# EAGLE schematic ss (EAGLE 6.1)
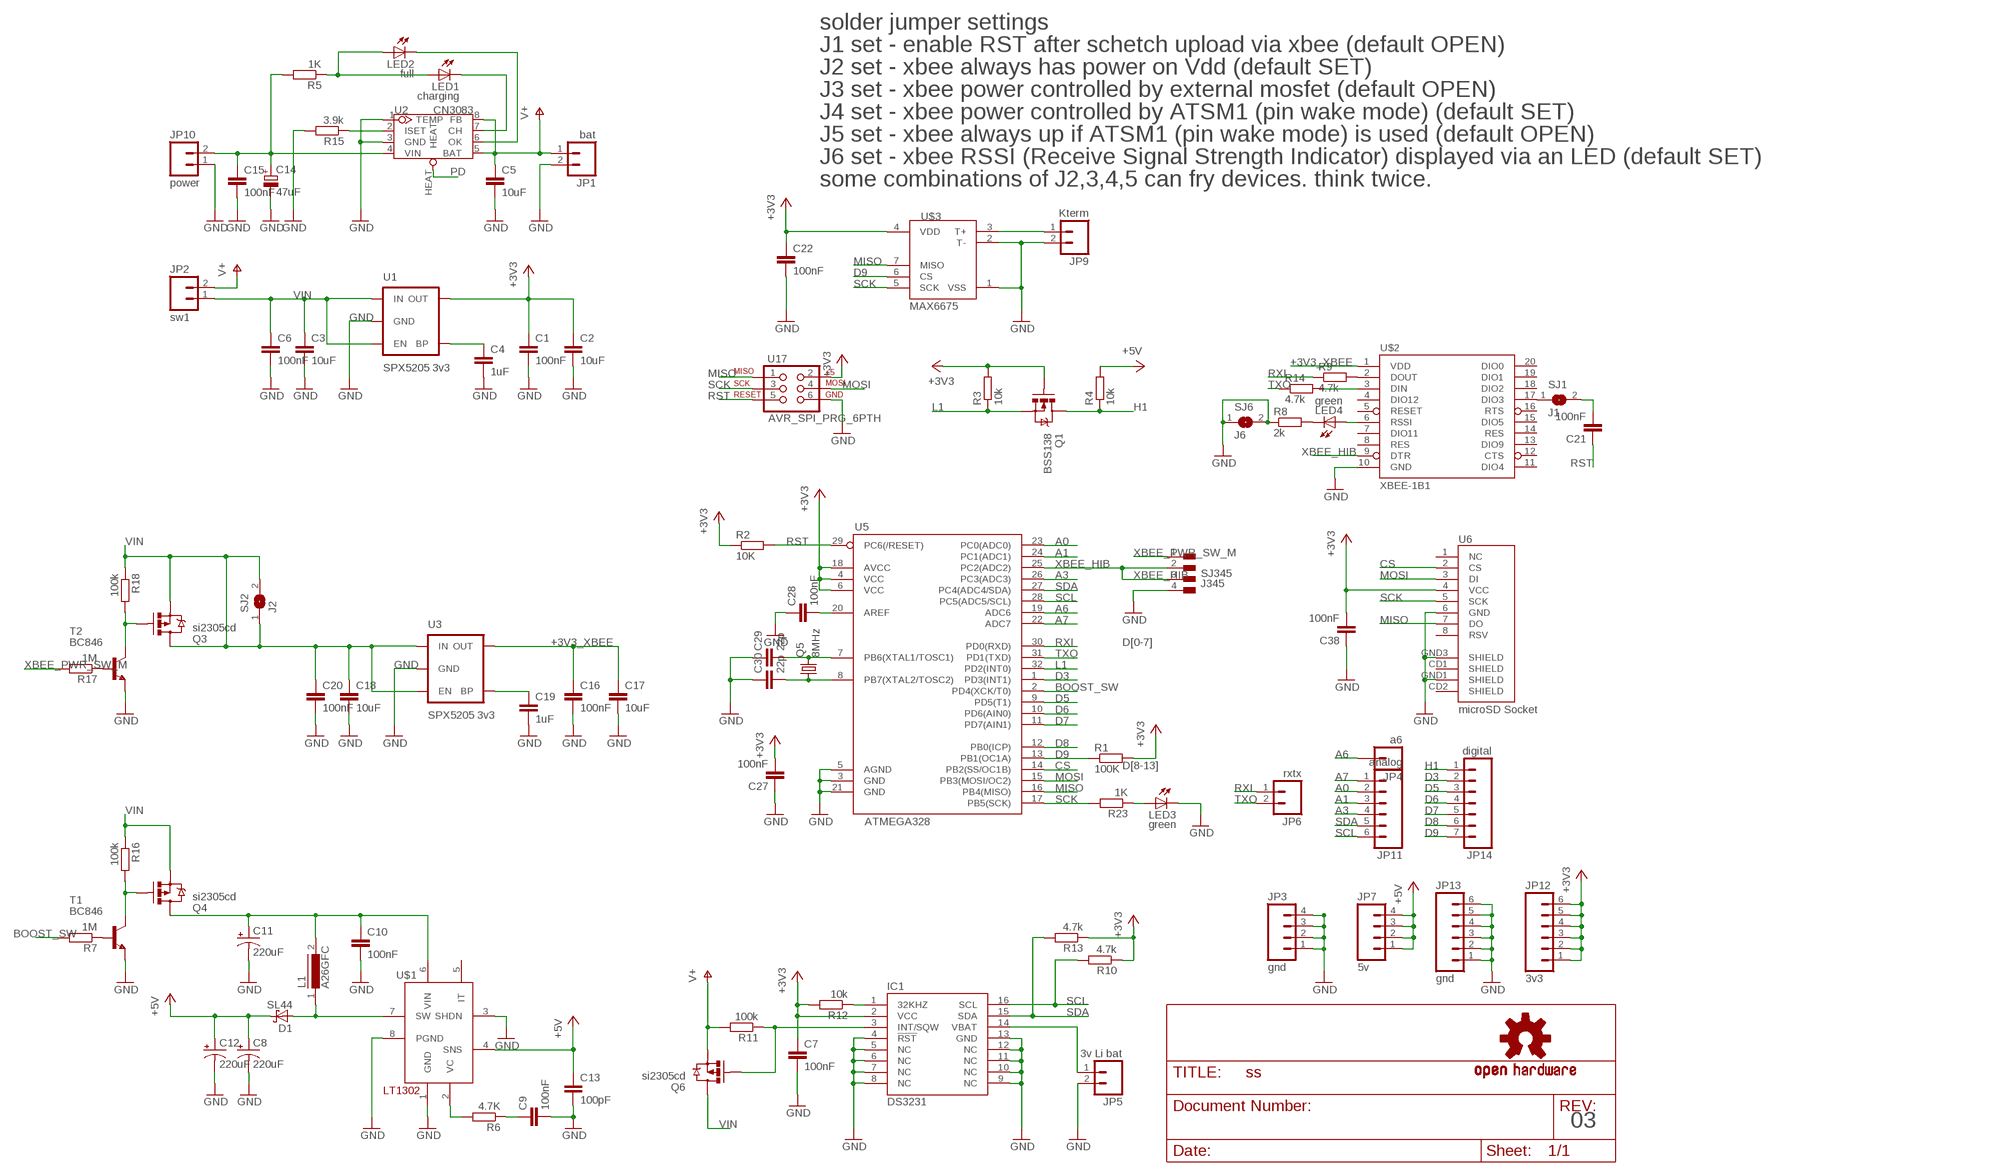
[diagram p0: schematic, sheet 1]

## Parts
C1  100nF  C-EUC0805  [C0805]
C2  10uF  C-EUC1206  [C1206]
C3  10uF  C-EUC1206  [C1206]
C4  1uF  C-EUC0805  [C0805]
C5  10uF  C-EUC1206  [C1206]
C6  100nF  C-EUC0805  [C0805]
C7  100nF  C-EUC0805  [C0805]
C8  220uF  CAP_POLD  [PANASONIC_D]
C9  100nF  C-EUC0805  [C0805]
C10  100nF  C-EUC0805  [C0805]
C11  220uF  CAP_POLD  [PANASONIC_D]
C12  220uF  CAP_POLD  [PANASONIC_D]
C13  100pF  C-EUC0805  [C0805]
C14  47uF  CPOL-EUCT7343  [CT7343]
C15  100nF  C-EUC0805  [C0805]
C16  100nF  C-EUC0805  [C0805]
C17  10uF  C-EUC1206  [C1206]
C18  10uF  C-EUC1206  [C1206]
C19  1uF  C-EUC0805  [C0805]
C20  100nF  C-EUC0805  [C0805]
C21  100nF  C-EUC0805  [C0805]
C22  100nF  C-EUC0805  [C0805]
C27  100nF  C-EUC0805  [C0805]
C28  100nF  C-EUC0805  [C0805]
C29  22p  C-EUC0805  [C0805]
C30  22p  C-EUC0805  [C0805]
C38  100nF  C-EUC0805  [C0805]
D1  SL44  SCHOTTKY-DIODESMC  [SMC]
IC1  DS3231  [SO-16]
JP1  bat  M02PTH  [1X02]
JP2  sw1  M02PTH  [1X02]
JP3  gnd  M04PTH  [1X04]
JP4  a6  M01PTH  [1X01]
JP5  3v Li bat  M02PTH  [1X02]
JP6  rxtx  M02PTH  [1X02]
JP7  5v  M04PTH  [1X04]
JP9  Kterm  M02PTH  [1X02]
JP10  power  M02PTH  [1X02]
JP11  analog  M06SIP  [1X06]
JP12  3v3  M06SIP  [1X06]
JP13  gnd  M06SIP  [1X06]
JP14  digital  M07  [1X07]
L1  A26GFC  [A26GFC]
LED1  charging  LEDCHIP-LED0805  [CHIP-LED0805]
LED2  full  LEDCHIP-LED0805  [CHIP-LED0805]
LED3  green  LEDCHIP-LED0805  [CHIP-LED0805]
LED4  green  LEDCHIP-LED0805  [CHIP-LED0805]
Q1  BSS138  MOSFET-NCHANNELSMD  [SOT23-3]
Q3  si2305cd  MOSFET-PCHANNELSMD_POWER  [SOT23-3_POWER]
Q4  si2305cd  MOSFET-PCHANNELSMD_POWER  [SOT23-3_POWER]
Q5  8MHz  CRYTAL  [CRYSTAL_5X3.2]
Q6  si2305cd  MOSFET-PCHANNELSMD_POWER  [SOT23-3_POWER]
R1  100K  R-EU_R0805W  [R0805W]
R2  10K  R-EU_R0805W  [R0805W]
R3  10k  R-EU_R0805W  [R0805W]
R4  10k  R-EU_R0805W  [R0805W]
R5  1K  R-EU_R0805W  [R0805W]
R6  4.7K  R-EU_R0805W  [R0805W]
R7  1M  R-EU_R0805W  [R0805W]
R8  2k  R-EU_R0805W  [R0805W]
R9  4.7k  R-EU_R0805W  [R0805W]
R10  4.7k  R-EU_R0805W  [R0805W]
R11  100k  R-EU_R0805W  [R0805W]
R12  10k  R-EU_R0805W  [R0805W]
R13  4.7k  R-EU_R0805W  [R0805W]
R14  4.7k  R-EU_R0805W  [R0805W]
R15  3.9k  R-EU_R0805W  [R0805W]
R16  100k  R-EU_R0805W  [R0805W]
R17  1M  R-EU_R0805W  [R0805W]
R18  100k  R-EU_R0805W  [R0805W]
R23  1K  R-EU_R0805W  [R0805W]
SJ1  J1  SJ  [SJ]
SJ2  J2  SJ  [SJ]
SJ6  J6  SJ  [SJ]
SJ345  J345  SJ_4P  [SJ_4P]
T1  BC846  [SOT23]
T2  BC846  [SOT23]
U1  SPX5205 3v3  V_REG_LDOSMD  [SOT23-5]
U2  CN3083  [SOP8-W/-HEAT]
U3  SPX5205 3v3  V_REG_LDOSMD  [SOT23-5]
U5  ATMEGA328  ATMEGA168  [TQFP32-08]
U6  microSD Socket  USD-SOCKETNEW  [MICRO-SD-SOCKET-PP]
U17  AVR_SPI_PRG_6PTH  [2X3]
U$1  LT1302SOIC8  [SO08]
U$2  XBEE-1B1  [XBEE-1]
U$3  MAX6675  [SO08-MAX6675]
U$7  OSHW-LOGOM  [OSHW-LOGO-M]

## Nets
+3V3: C1.1 C2.1 C7.1 C22.1 C27.2 C38.2 IC1.2(VCC) JP12.1 JP12.2 JP12.3 JP12.4 JP12.5 JP12.6 Q1.1(G) R1.2 R2.1 R3.2 R10.1 R12.2 R13.1 U1.5(OUT) U5.4(VCC) U5.6(VCC) U5.18(AVCC) U6.4(VCC) U17.2 U$3.4(VDD)
+3V3_XBEE: C16.1 C17.1 U3.5(OUT) U$2.1(VDD)
+5V: C8.+ C12.+ C13.1 D1.C JP7.1 JP7.2 JP7.3 JP7.4 R4.2 U$1.4(SNS)
A0: JP11.2 U5.23(PC0(ADC0))
A1: JP11.3 U5.24(PC1(ADC1))
A3: JP11.4 U5.26(PC3(ADC3))
A6: JP4.1 U5.19(ADC6)
A7: JP11.1 U5.22(ADC7)
BOOST_IN: C10.1 C11.+ L1.2 Q4.3(D) U$1.6(VIN)
BOOST_SW: R7.2 U5.2(PD4(XCK/T0))
CS: U5.14(PB2(SS/OC1B)) U6.2(CS)
D3: JP14.2 U5.1(PD3(INT1))
D5: JP14.3 U5.9(PD5(T1))
D6: JP14.4 U5.10(PD6(AIN0))
D7: JP14.5 U5.11(PD7(AIN1))
D8: JP14.6 U5.12(PB0(ICP))
D9: JP14.7 R1.1 U5.13(PB1(OC1A)) U$3.6(CS)
GND: C1.2 C2.2 C3.2 C4.2 C5.2 C6.2 C7.2 C8.- C9.2 C10.2 C11.- C12.- C13.2 C14.- C15.2 C16.2 C17.2 C18.2 C19.2 C20.2 C22.2 C27.1 C28.1 C29.1 C30.1 C38.1 IC1.4(!RST) IC1.5(NC) IC1.6(NC) IC1.7(NC) IC1.8(NC) IC1.9(NC) IC1.10(NC) IC1.11(NC) IC1.12(NC) IC1.13(GND) JP1.2 JP3.1 JP3.2 JP3.3 JP3.4 JP5.2 JP9.2 JP10.1 JP13.1 JP13.2 JP13.3 JP13.4 JP13.5 JP13.6 LED3.C R8.1 R15.2 SJ6.1 SJ6.2 SJ345.4 T1.2(E) T2.2(E) U1.2(GND) U2.1(TEMP) U2.3(GND) U3.2(GND) U5.3(GND) U5.5(AGND) U5.21(GND) U6.6(GND) U6.GND1(SHIELD) U6.GND3(SHIELD) U17.6 U$1.1(GND) U$1.3(SHDN) U$1.8(PGND) U$2.10(GND) U$3.1(VSS) U$3.2(T-)
H1: JP14.1 Q1.3(D) R4.1
L1: Q1.2(S) R3.1 U5.32(PD2(INT0))
MISO: U5.16(PB4(MISO)) U6.7(DO) U17.1 U$3.7(MISO)
MOSI: U5.15(PB3(MOSI/OC2)) U6.3(DI) U17.4
N$1: IC1.3(INT/SQW) Q6.1(G) R11.1
N$2: C4.1 U1.4(BP)
N$3: D1.A L1.1 U$1.7(SW)
N$4: SJ1.1 U$2.17(DIO3)
N$5: C19.1 U3.4(BP)
N$6: LED4.C R8.2
N$7: LED4.A U$2.6(RSSI)
N$8: IC1.1(32KHZ) R12.1
N$9: R15.1 U2.2(ISET)
N$10: IC1.14(VBAT) JP5.1
N$11: R6.2 U$1.2(VC)
N$12: C14.+ C15.1 JP10.2 R5.2 U2.4(VIN)
N$13: C9.1 R6.1
N$14: LED1.A LED2.A R5.1
N$15: LED1.C U2.7(CH)
N$16: LED2.C U2.6(OK)
N$17: C21.2 SJ1.2
N$18: R17.1 T2.1(B)
N$19: C30.2 Q5.P$1 U5.8(PB7(XTAL2/TOSC2))
N$20: Q3.1(G) R18.2 T2.3(C)
N$21: C29.2 Q5.P$2 U5.7(PB6(XTAL1/TOSC1))
N$22: C28.2 U5.20(AREF)
N$24: R9.2 U$2.2(DOUT)
N$25: R14.2 U$2.3(DIN)
N$26: R7.1 T1.1(B)
N$27: Q4.1(G) R16.2 T1.3(C)
N$34: LED3.A R23.1
PD: U2.HEAT
RST: C21.1 R2.2 U5.29(PC6(/RESET)) U17.5
RXI: JP6.1 R9.1 U5.30(PD0(RXD))
SCK: R23.2 U5.17(PB5(SCK)) U6.5(SCK) U17.3 U$3.5(SCK)
SCL: IC1.16(SCL) JP11.6 R10.2 U5.28(PC5(ADC5/SCL))
SDA: IC1.15(SDA) JP11.5 R13.2 U5.27(PC4(ADC4/SDA))
T+: JP9.1 U$3.3(T+)
TXO: JP6.2 R14.1 U5.31(PD1(TXD))
V+: C5.1 JP1.1 JP2.2 Q6.2(S) R11.2 U2.5(BAT) U2.8(FB)
VIN: C3.1 C6.1 C18.1 C20.1 JP2.1 Q3.2(S) Q3.3(D) Q4.2(S) Q6.3(D) R16.1 R18.1 SJ2.1 SJ2.2 U1.1(IN) U1.3(EN) U3.1(IN) U3.3(EN)
XBEE_HIB: SJ345.2 SJ345.3 U5.25(PC2(ADC2)) U$2.9(DTR)
XBEE_PWR_SW_M: R17.2 SJ345.1
Unconnected: U6.1(NC) U6.8(RSV) U6.CD1(SHIELD) U6.CD2(SHIELD) U$1.5(IT) U$2.4(DIO12) U$2.5(RESET) U$2.7(DIO11) U$2.8(RES) U$2.11(DIO4) U$2.12(CTS) U$2.13(DIO9) U$2.14(RES) U$2.15(DIO5) U$2.16(RTS) U$2.18(DIO2) U$2.19(DIO1) U$2.20(DIO0)

## Notes on the sheet
- solder jumper settings
- J1 set - enable RST after schetch upload via xbee (default OPEN)
- J2 set - xbee always has power on Vdd (default SET)
- J3 set - xbee power controlled by external mosfet (default OPEN)
- J4 set - xbee power controlled by ATSM1 (pin wake mode) (default SET)
- J5 set - xbee always up if ATSM1 (pin wake mode) is used (default OPEN)
- J6 set - xbee RSSI (Receive Signal Strength Indicator) displayed via an LED (default SET)
- some combinations of J2,3,4,5 can fry devices. think twice.
- D[0-7]
- D[8-13]
- 03

## Library data of the parts
C1-C7 C9 C10 C13 C15-C22 C27-C30 C38 = rcl:C-EU: CAPACITOR, European symbol
C8 C11 C12 = SparkFun:CAP_POL: Capacitor Polarized These are standard SMD and PTH capacitors. Normally 10uF, 47uF, and 100uF in electrolytic and tantalum varieties. Always verify the external diameter of the through hole cap, it varies with capacity, voltage, and manufacturer. The EIA devices should be standard.
C14 = rcl:CPOL-EU: POLARIZED CAPACITOR, European symbol
D1 = diode:SCHOTTKY-DIODE: Schottky Diode
IC1 = ds3231:DS3231: DS3231 RTC
JP1 JP2 JP5 JP6 JP9 JP10 = SparkFun:M02: Header 2 Standard 2-pin 0.1" header. Use with straight break away headers (SKU : PRT-00116), right angle break away headers (PRT-00553), swiss pins (PRT-00743), machine pins (PRT-00117), and female headers (PRT-00115). Molex polarized connector foot print use with SKU : PRT-08233 with associated crimp pins and housings.
JP3 JP7 = SparkFun:M04: Header 4 Standard 4-pin 0.1" header. Use with straight break away headers (SKU : PRT-00116), right angle break away headers (PRT-00553), swiss pins (PRT-00743), machine pins (PRT-00117), and female headers (PRT-00115). Molex polarized connector foot print use with SKU : PRT-08231 with associated crimp pins and housings. 1MM SMD Version SKU: PRT-10208
JP4 = SparkFun-Connectors:M01: Header 1 Standard 1-pin 0.1" header. Use with straight break away headers (SKU : PRT-00116), right angle break away headers (PRT-00553), swiss pins (PRT-00743), machine pins (PRT-00117), and female headers (PRT-00115).
JP11-JP13 = SparkFun:M06: Header 6 Standard 6-pin 0.1" header. Use with straight break away headers (SKU : PRT-00116), right angle break away headers (PRT-00553), swiss pins (PRT-00743), machine pins (PRT-00117), and female headers (PRT-00115). Molex polarized connector foot print use with SKU : PRT-08094 with associated crimp pins and housings. NOTES ON THE VARIANTS LOCK and LOCK_LONGPADS... This footprint was designed to help hold the alignment of a through-hole component (i.e. 6-pin header) while soldering it into place. You may notice that each hole has been shifted either up or down by 0.005 of an inch from it's more standard position (which is a perfectly straight line). This slight alteration caused the pins (the squares in the middle) to touch the edges of the holes. Because they are alternating, it causes a "brace" to hold the component in place. 0.005 has proven to be the perfect amount of "off-center" position when using our standard breakaway headers. Although looks a little odd when you look at the bare footprint, once you have a header in there, the alteration is very hard to notice. Also, if you push a header all the way into place, it is covered up entirely on the bottom side. This idea of altering the position of holes to aid alignment will be further integrated into the Sparkfun Library for other footprints. It can help hold any component with 3 or more connection pins.
JP14 = SparkFun-Connectors:M07: Header 7 Standard 7-pin 0.1" header. Use with straight break away headers (SKU : PRT-00116), right angle break away headers (PRT-00553), swiss pins (PRT-00743), machine pins (PRT-00117), and female headers (PRT-00115). NOTES ON THE VARIANTS LOCK and LOCK_LONGPADS... This footprint was designed to help hold the alignment of a through-hole component (i.e. 7-pin header) while soldering it into place. You may notice that each hole has been shifted either up or down by 0.005 of an inch from it's more standard position (which is usually a perfectly straight line). This slight alteration caused the pins (the squares in the middle) to touch the edges of the holes. Because they are alternating, it causes a "brace" to hold the header in place. 0.005 has proven to be the perfect amount of "off-center" position when using our standard breakaway headers. Although looks a little odd when you look at the bare footprint, once you have a header in there, the alteration is very hard to notice. Also, if you push a header all the way into place, it is covered up entirely on the bottom side. This idea of altering the position of holes to aid alignment will be further integrated into the Sparkfun Library for other footprints. It can help hold any component with 3 or more connection pins.
L1 = inductors:A26GFC: INDUCTOR
LED1-LED4 = led:LED: LED OSRAM: - CHIPLED LG R971, LG N971, LY N971, LG Q971, LY Q971, LO R971, LY R971 LH N974, LH R974 LS Q976, LO Q976, LY Q976 LO Q996 - Hyper CHIPLED LW Q18S LB Q993, LB Q99A, LB R99A - SideLED LS A670, LO A670, LY A670, LG A670, LP A670 LB A673, LV A673, LT A673, LW A673 LH A674 LY A675 LS A676, LA A676, LO A676, LY A676, LW A676 LS A679, LY A679, LG A679 - Hyper Micro SIDELED® LS Y876, LA Y876, LO Y876, LY Y876 LT Y87S - SmartLED LW L88C, LW L88S LB L89C, LB L89S, LG L890 LS L89K, LO L89K, LY L89K LS L896, LA L896, LO L896, LY L896 - TOPLED LS T670, LO T670, LY T670, LG T670, LP T670 LSG T670, LSP T670, LSY T670, LOP T670, LYG T670 LG T671, LOG T671, LSG T671 LB T673, LV T673, LT T673, LW T673 LH T674 LS T676, LA T676, LO T676, LY T676, LB T676, LH T676, LSB T676, LW T676 LB T67C, LV T67C, LT T67C, LS T67K, LO T67K, LY T67K, LW E67C LS E67B, LA E67B, LO E67B, LY E67B, LB E67C, LV E67C, LT E67C LW T67C LS T679, LY T679, LG T679 LS T770, LO T770, LY T770, LG T770, LP T770 LB T773, LV T773, LT T773, LW T773 LH T774 LS E675, LA E675, LY E675, LS T675 LS T776, LA T776, LO T776, LY T776, LB T776 LHGB T686 LT T68C, LB T68C - Hyper Mini TOPLED® LB M676 - Mini TOPLED Santana® LG M470 LS M47K, LO M47K, LY M47K Source: http://www.osram.convergy.de/
Q1 = SparkFun:MOSFET-NCHANNEL
Q3 Q4 Q6 = Simplex-DiscreteSemi:MOSFET-PCHANNEL: Generic PMOSFET
Q5 = Omat_komponentit:CRYTAL: CRYSTAL
R1-R18 R23 = rcl:R-EU_: RESISTOR, European symbol
SJ1 SJ2 SJ6 = jumper:SJ: SMD solder JUMPER
SJ345 = Simplex-Jumpers:SJ_4P: solder jumper 4pin
T1 T2 = transistor:BC846: NPN TRANSISTOR
U1 U3 = SparkFun:V_REG_LDO: Voltage Regulator LDO Standard 150mA LDO voltage regulator in SOT-23 layout. Micrel part MIC5205. BP (by-pass) pin is used to lower output noise with 470pF cap.
U2 = IC:CN3083
U5 = SparkFun:ATMEGA168
U6 = SparkFun:USD-SOCKET: microSD Socket Push-push type uSD socket. Schematic element and footprint production proven. Spark Fun Electronics SKU : PRT-00127. tDoc lines correctly indicate media card edge positions when inserting (unlocked, locked, depressed).
U17 = SparkFun:AVR_SPI_PRG_6: AVR ISP 6 Pin This is the reduced ISP connector for AVR programming. Common on Arduino. This footprint will take up less PCB space and can be used with a 10-pin to 6-pin adapter such as SKU: BOB-08508
U$1 = mine:LT1302
U$2 = SparkFun:XBEE-1
U$3 = SparkFun-AnalogIC:MAX6675: K-type thermocouple ADC, SPI output
U$7 = SparkFun:OSHW-LOGO: Open Source Hardware Logo This logo indicates the piece of hardware it is found on incorporates a OSHW license and/or adheres to the definition of open source hardware found here: http://freedomdefined.org/OSHW

## Net classes
1 vcc: width 0.203 mm